# EAGLE design RfAddon (EAGLE 5.09)
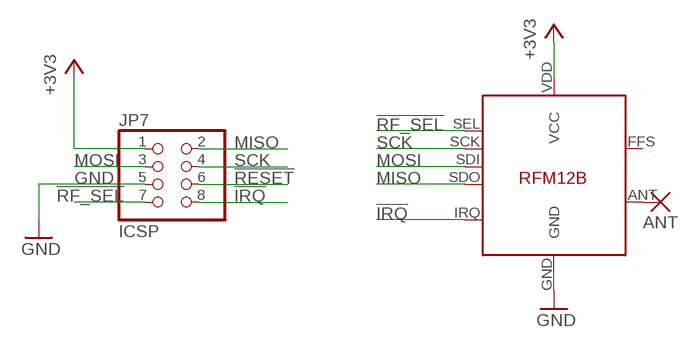
[diagram p0: schematic, sheet 1]

## Parts
ANT  THROUGH-HOLE  [PAD]
JP7  ICSP  PINHD-2X4  [2X04]
U$1  RFM12B  [RFM12B]

## Nets
!IRQ: JP7.8 U$1.IRQ
!RESET: JP7.6
!RF_SEL: JP7.7 U$1.SEL
+3V3 [POW]: JP7.1 U$1.VDD(VCC)
GND [HIGHPOW]: JP7.5 U$1.GND
MISO: JP7.2 U$1.SDO
MOSI: JP7.3 U$1.SDI
N$5: ANT.P U$1.ANT
SCK: JP7.4 U$1.SCK
Unconnected: U$1.FFS

## Library data of the parts
ANT = Bryan:THROUGH-HOLE
JP7 = pinhead:PINHD-2X4: PIN HEADER
U$1 = JeeLabs:RFM12B

## Net classes
0 default: width 0.305 mm
1 POW: width 0.381 mm
2 HIGHPOW: width 0.381 mm
3 GND: width 0.381 mm

## Board
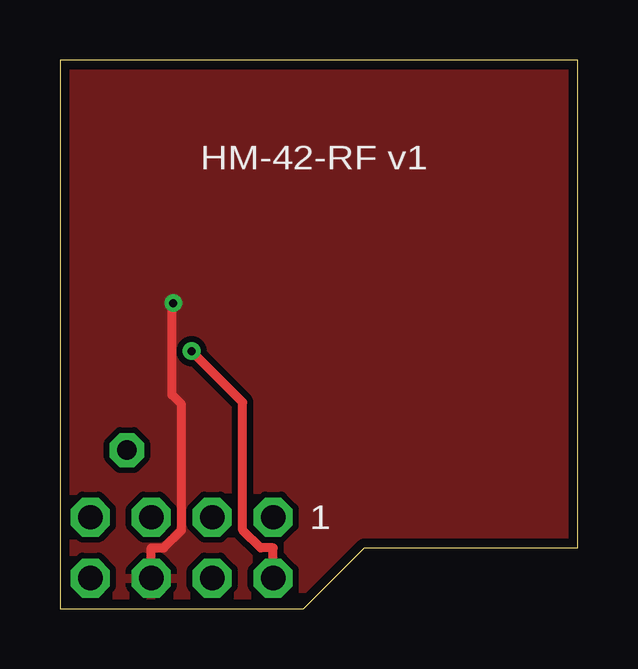
[diagram p1: board, top side]
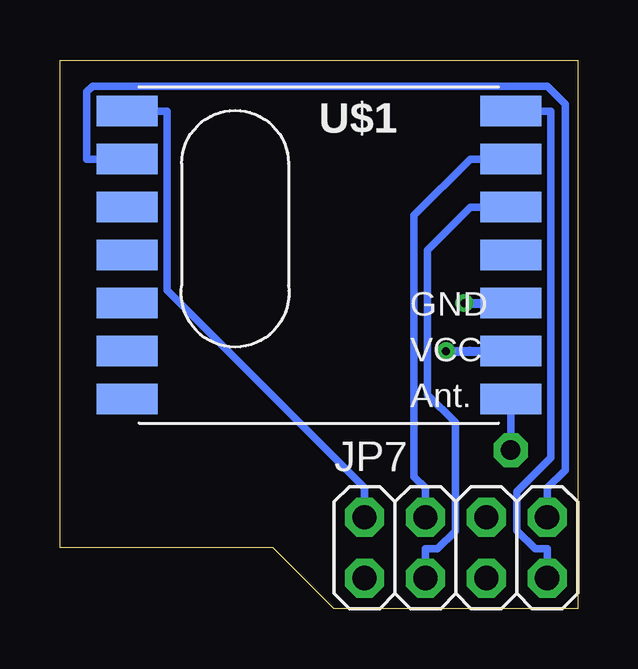
[diagram p2: board, bottom side, seen from below]

Size 21.59 x 22.86 mm. Coordinates in mm from the lower left corner, seen from the top.
Outline: 0,0 10.16,0 12.7,2.54 21.59,2.54 21.59,22.86 0,22.86 0,0
Copper layers (1*16): Top 0.035mm / dielectric 1.5mm / Bottom 0.035mm
Design rules "BryTest *": minimum track width 12mil, minimum drill 13mil, track to track 10mil, track to pad 10mil, pad to pad 10mil, via to via 10mil, smd to smd 10mil, copper to edge 15mil, drill to drill 20mil, minimum pad ring 12mil, minimum via ring 8mil, stop-mask expansion 4mil, vias tented up to drill 24mil, thermal gap 10mil

### Footprints (pad centres in the part's own frame; a part is rotated, then mirrored left to right if it is on the bottom)
PAD = drill 0.813 octagon: P 0,0
2X04 = drill 1.016 octagon: 1 -3.81,-1.27; 2 -3.81,1.27; 3 -1.27,-1.27; 4 -1.27,1.27; 5 1.27,-1.27; 6 1.27,1.27; 7 3.81,-1.27; 8 3.81,1.27
RFM12B = smd 2.54 x 1.27: ANT 8,-6; FFS -8,2; GND 8,-2; IRQ -8,4; P$8 -8,0; P$9 -8,-2; P$10 -8,-4; P$12 -8,-6; P$16 8,0; SCK 8,4; SDI 8,2; SDO -8,6; SEL 8,6; VDD 8,-4

### Placement (x,y rotation side)
ANT  2.79,6.6 0 bottom
JP7  5.08,2.54 0 bottom
U$1  10.79,14.73 0 bottom

### Tracks (layer width: path | path; a pad name or v marks a point on that pad's centre or on a via)
!IRQ
  Bottom 0.305: JP7.8 1.27,5.03 0.52,5.78 0.52,21.03 1.27,21.77 20.23,21.77 20.47,21.54 20.47,18.73 U$1.IRQ
!RF_SEL
  Bottom 0.305: JP7.7 1.27,2.49 1.77,2.49 2.54,3.25 2.54,4.87 1.12,6.29 1.12,20.73 U$1.SEL
+3V3  (via drill 0.33 pad 0.74)
  Top 0.381: v5.49,10.73 7.62,8.6 7.62,3.28 8.37,2.53 8.89,2.53 JP7.1
  Bottom 0.381: v5.49,10.73 4.51,10.73 U$1.VDD
GND  (via drill 0.33 pad 0.74)
  Top 0.381: v4.72,12.73 4.67,12.68 4.67,8.91 5.07,8.51 5.07,3.26 4.33,2.53 3.81,2.53 JP7.5
  Bottom 0.381: v4.72,12.73 4.51,12.73 U$1.GND
  pour Top: 0,0 10.16,0 12.7,2.54 21.59,2.54 21.59,22.86 0,22.86
MISO
  Bottom 0.305: JP7.2 8.89,5.03 17.12,13.26 17.12,20.73 U$1.SDO
MOSI
  Bottom 0.305: JP7.3 6.35,2.49 5.84,2.49 5.11,3.23 5.11,7.77 6.26,8.92 6.26,14.94 4.47,16.73 U$1.SDI
N$5
  Bottom 0.305: U$1.ANT ANT.P
SCK
  Bottom 0.305: JP7.4 6.35,5.03 6.82,5.5 6.82,16.38 4.47,18.73 U$1.SCK

### Text on the board
tNames: HM-42-RF v1 | 1